# EAGLE design 12_BCKPLN_FPGA_J008340C (EAGLE 7.7.0)

## Sheet 1 of 2
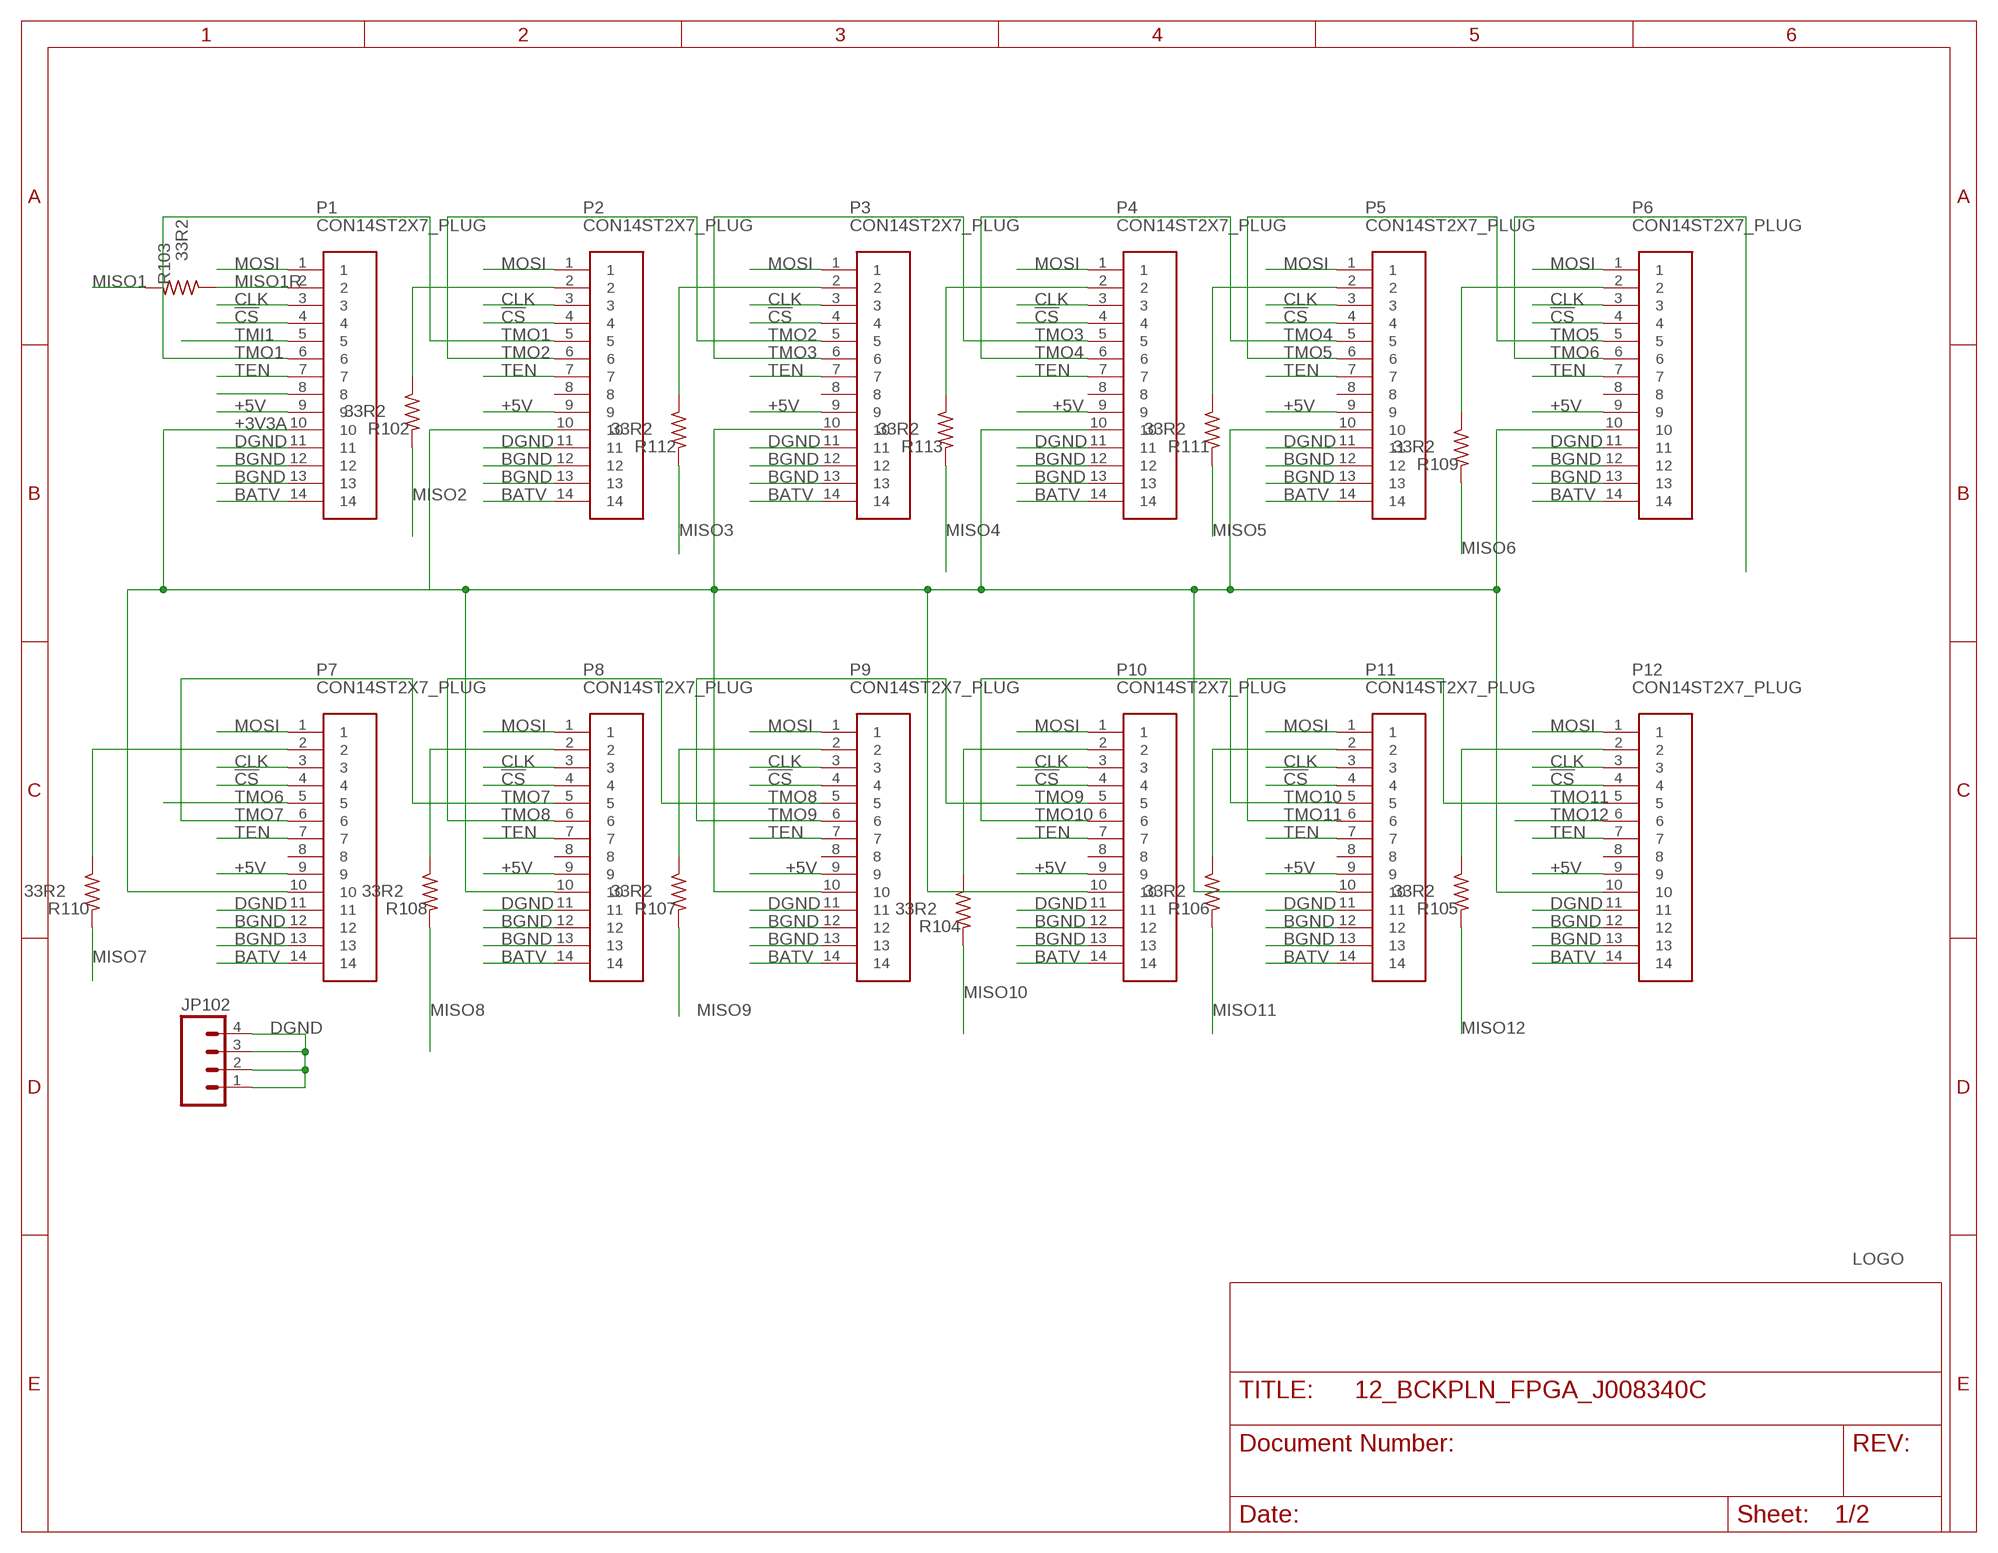
[diagram p0: schematic, sheet 1]

### Parts
JP102  M04LOCK  [1X04_LOCK]
P1  CON14ST2X7_PLUG  [2X7_PLUG]
P2  CON14ST2X7_PLUG  [2X7_PLUG]
P3  CON14ST2X7_PLUG  [2X7_PLUG]
P4  CON14ST2X7_PLUG  [2X7_PLUG]
P5  CON14ST2X7_PLUG  [2X7_PLUG]
P6  CON14ST2X7_PLUG  [2X7_PLUG]
P7  CON14ST2X7_PLUG  [2X7_PLUG]
P8  CON14ST2X7_PLUG  [2X7_PLUG]
P9  CON14ST2X7_PLUG  [2X7_PLUG]
P10  CON14ST2X7_PLUG  [2X7_PLUG]
P11  CON14ST2X7_PLUG  [2X7_PLUG]
P12  CON14ST2X7_PLUG  [2X7_PLUG]
R102  33R2  RESISTOR_SM0805S  [0805S]
R103  33R2  RESISTOR_SM0805S  [0805S]
R104  33R2  RESISTOR_SM0805S  [0805S]
R105  33R2  RESISTOR_SM0805S  [0805S]
R106  33R2  RESISTOR_SM0805S  [0805S]
R107  33R2  RESISTOR_SM0805S  [0805S]
R108  33R2  RESISTOR_SM0805S  [0805S]
R109  33R2  RESISTOR_SM0805S  [0805S]
R110  33R2  RESISTOR_SM0805S  [0805S]
R111  33R2  RESISTOR_SM0805S  [0805S]
R112  33R2  RESISTOR_SM0805S  [0805S]
R113  33R2  RESISTOR_SM0805S  [0805S]
U$1  JFRC-LOGOLOGO_OP  [LOGO_BMP_OP]

### Nets
!CS: P1.4 P2.4 P3.4 P4.4 P5.4 P6.4 P7.4 P8.4 P9.4 P10.4 P11.4 P12.4 ; also sheet 2
+3V3A: P1.10 P2.10 P3.10 P4.10 P5.10 P6.10 P7.10 P8.10 P9.10 P10.10 P11.10 P12.10 ; also sheet 2
+5V: P1.9 P2.9 P3.9 P4.9 P5.9 P6.9 P7.9 P8.9 P9.9 P10.9 P11.9 P12.9 ; also sheet 2
BATV: P1.14 P2.14 P3.14 P4.14 P5.14 P6.14 P7.14 P8.14 P9.14 P10.14 P11.14 P12.14 ; also sheet 2
BGND: P1.12 P1.13 P2.12 P2.13 P3.12 P3.13 P4.12 P4.13 P5.12 P5.13 P6.12 P6.13 P7.12 P7.13 P8.12 P8.13 P9.12 P9.13 P10.12 P10.13 P11.12 P11.13 P12.12 P12.13 ; also sheet 2
CLK: P1.3 P2.3 P3.3 P4.3 P5.3 P6.3 P7.3 P8.3 P9.3 P10.3 P11.3 P12.3 ; also sheet 2
DGND: JP102.1 JP102.2 JP102.3 JP102.4 P1.11 P2.11 P3.11 P4.11 P5.11 P6.11 P7.11 P8.11 P9.11 P10.11 P11.11 P12.11 ; also sheet 2
MISO1: R103.2 ; also sheet 2
MISO1R: P1.2 R103.1
MISO2: R102.2 ; also sheet 2
MISO3: R112.2 ; also sheet 2
MISO4: R113.2 ; also sheet 2
MISO5: R111.2 ; also sheet 2
MISO6: R109.2 ; also sheet 2
MISO7: R110.2 ; also sheet 2
MISO8: R108.2 ; also sheet 2
MISO9: R107.2 ; also sheet 2
MISO10: R104.2 ; also sheet 2
MISO11: R106.2 ; also sheet 2
MISO12: R105.2 ; also sheet 2
MOSI: P1.1 P2.1 P3.1 P4.1 P5.1 P6.1 P7.1 P8.1 P9.1 P10.1 P11.1 P12.1 ; also sheet 2
N$13: P2.2 R102.1
N$14: P3.2 R112.1
N$17: P1.8
N$24: P4.2 R113.1
N$25: P5.2 R111.1
N$28: P6.2 R109.1
N$31: P12.2 R105.1
N$32: P11.2 R106.1
N$33: P10.2 R104.1
N$34: P9.2 R107.1
N$35: P8.2 R108.1
N$36: P7.2 R110.1
TEN: P1.7 P2.7 P3.7 P4.7 P5.7 P6.7 P7.7 P8.7 P9.7 P10.7 P11.7 P12.7 ; also sheet 2
TMI1: P1.5 ; also sheet 2
TMO1: P1.6 P2.5
TMO2: P2.6 P3.5
TMO3: P3.6 P4.5
TMO4: P4.6 P5.5
TMO5: P5.6 P6.5
TMO6: P6.6 P7.5
TMO7: P7.6 P8.5
TMO8: P8.6 P9.5
TMO9: P9.6 P10.5
TMO10: P10.6 P11.5
TMO11: P11.6 P12.5
TMO12: P12.6 ; also sheet 2
Unconnected: P2.8 P3.8 P4.8 P5.8 P6.8 P7.8 P8.8 P9.8 P10.8 P11.8 P12.8

## Sheet 2 of 2
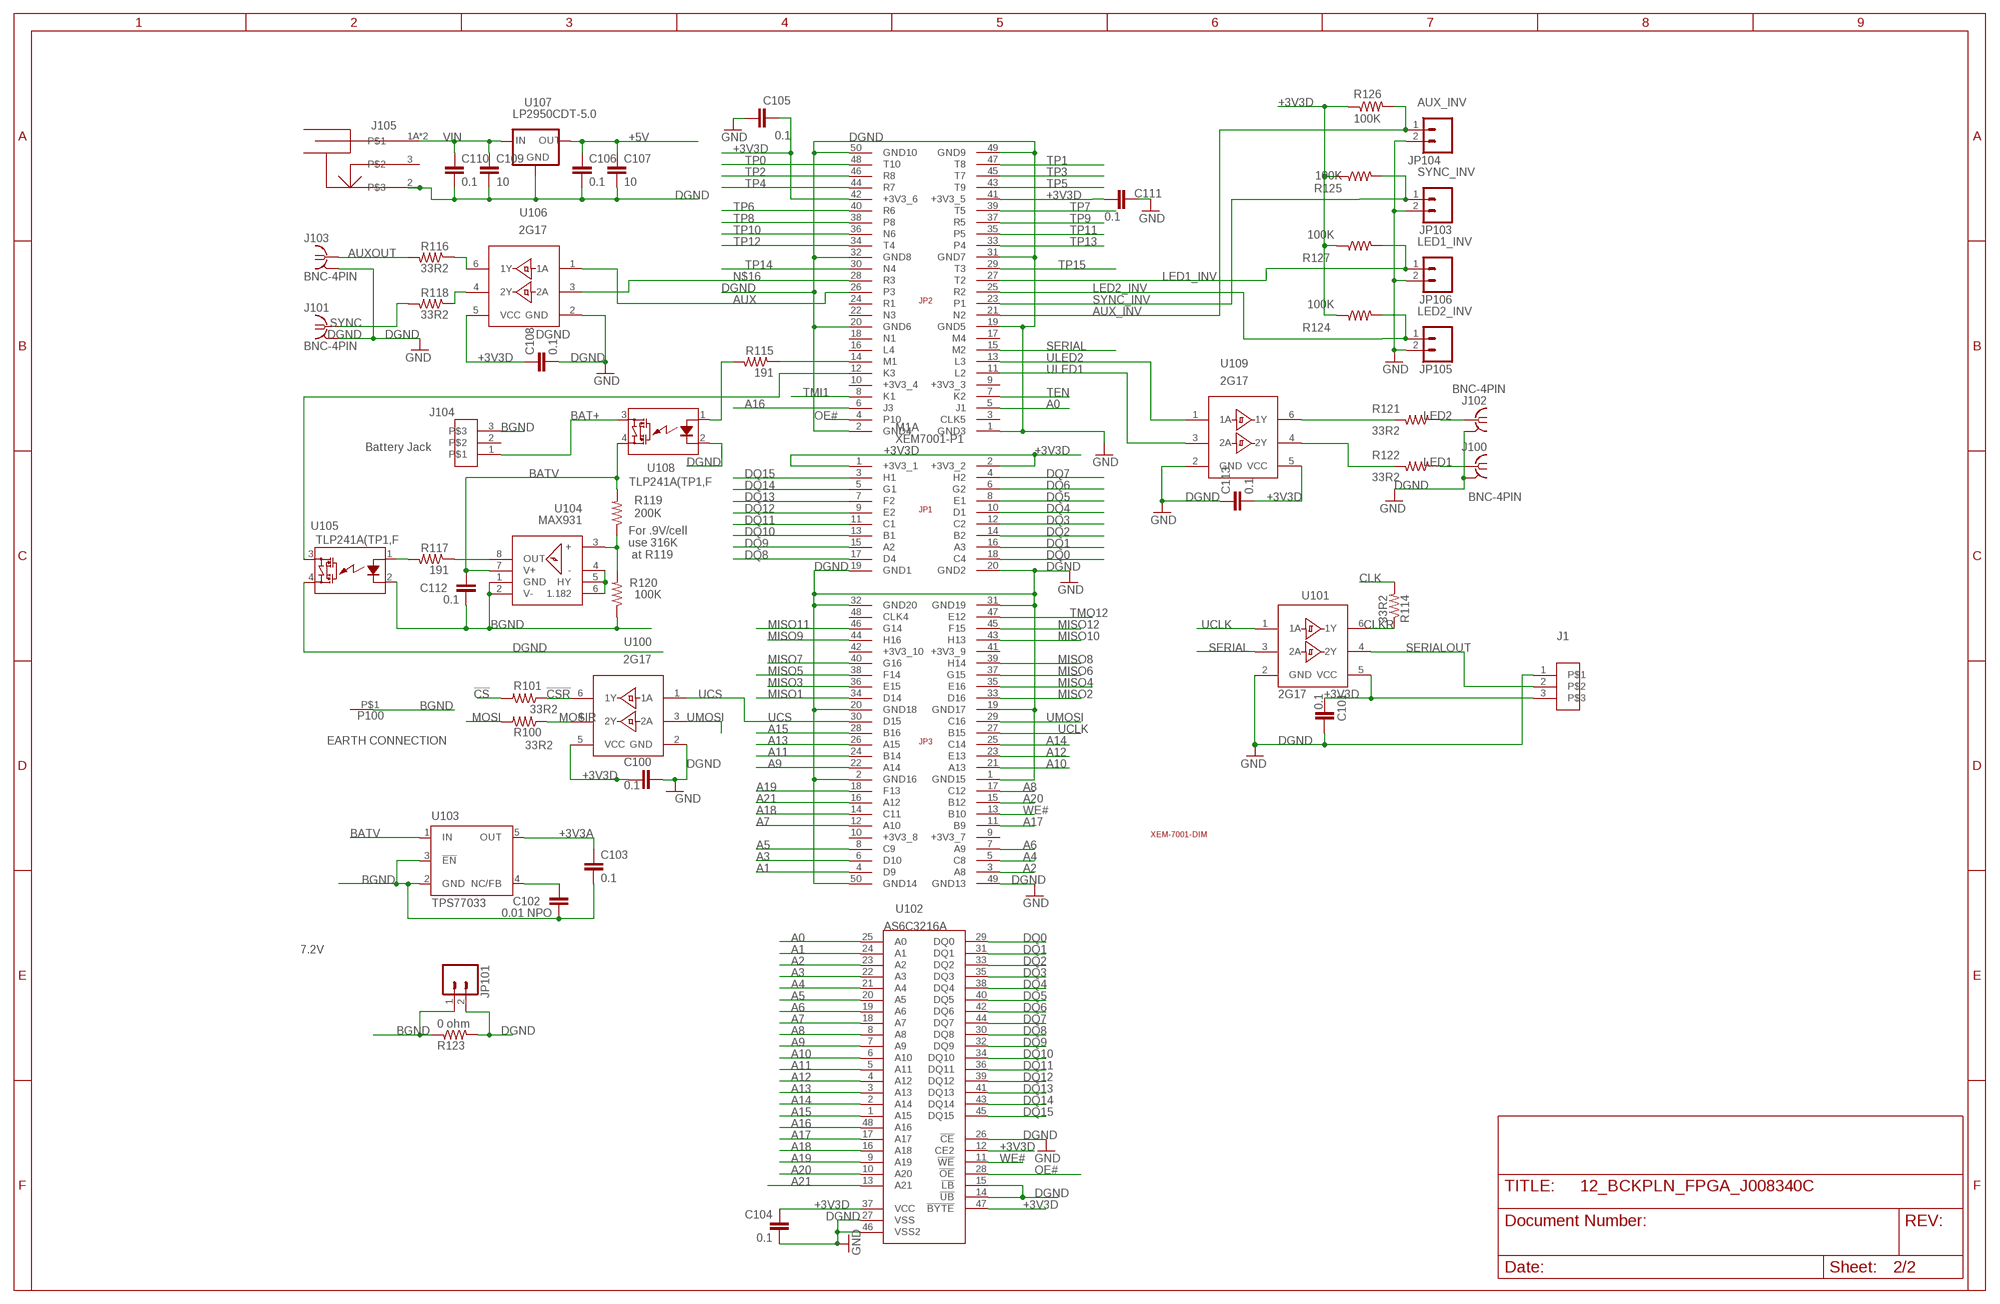
[diagram p1: schematic, sheet 2]

### Parts
C100  0.1  CAPS0603S  [0603S]
C101  0.1  CAPS0603S  [0603S]
C102  0.01 NPO  CAPS0805S  [0805S]
C103  0.1  CAPS0603S  [0603S]
C104  0.1  CAPS0603S  [0603S]
C105  0.1  CAPS0603S  [0603S]
C106  0.1  CAPS0603S  [0603S]
C107  10  CAPS1210S  [1210S]
C108  0.1  CAPS0603S  [0603S]
C109  10  CAPS1210S  [1210S]
C110  0.1  CAPS0603S  [0603S]
C111  0.1  CAPS0603S  [0603S]
C112  0.1  CAPS0603S  [0603S]
C113  0.1  CAPS0603S  [0603S]
J1  CON3AMPMODU-3  [AMPMODU-3]
J100  BNC-4PIN  BNCBNC-4PIN  [BNC-4PIN]
J101  BNC-4PIN  BNCBNC-4PIN  [BNC-4PIN]
J102  BNC-4PIN  BNCBNC-4PIN  [BNC-4PIN]
J103  BNC-4PIN  BNCBNC-4PIN  [BNC-4PIN]
J104  Battery Jack  CON3975  [975]
J105  POWER_JACK_SHUNTPJ-002  [PJ-002]
JP101  M02LOCK  [1X02_LOCK]
JP103  M02LOCK  [1X02_LOCK]
JP104  M02LOCK  [1X02_LOCK]
JP105  M02LOCK  [1X02_LOCK]
JP106  M02LOCK  [1X02_LOCK]
M1  XEM7001-OUTLINE  [XEM7001-OUTLINE]
M1A  XEM7001-P1  [2X10]
M1B  XEM7001-P2  [2X25]
M1C  XEM7001-P3  [2X25]
P100  CON1BANANA-1  [BANANA-1]
R100  33R2  RESISTOR_SM0805S  [0805S]
R101  33R2  RESISTOR_SM0805S  [0805S]
R114  33R2  RESISTOR_SM0805S  [0805S]
R115  191  RESISTOR_SM0805S  [0805S]
R116  33R2  RESISTOR_SM0805S  [0805S]
R117  191  RESISTOR_SM0805S  [0805S]
R118  33R2  RESISTOR_SM0805S  [0805S]
R119  200K  RESISTOR_SM0805S  [0805S]
R120  100K  RESISTOR_SM0805S  [0805S]
R121  33R2  RESISTOR_SM0805S  [0805S]
R122  33R2  RESISTOR_SM0805S  [0805S]
R123  0 ohm  RESISTOR_SM0805S  [0805S]
R124  100K  RESISTOR_SM0805S  [0805S]
R125  100K  RESISTOR_SM0805S  [0805S]
R126  100K  RESISTOR_SM0805S  [0805S]
R127  100K  RESISTOR_SM0805S  [0805S]
U100  2G17  [SOT23-6]
U101  2G17  [SOT23-6]
U102  AS6C3216A  [TSSOP48-12X20]
U103  TPS77033  [SOT23-DBV]
U104  MAX931  [SOIC8]
U105  TLP241A(TP1,F  RELAY_SSRSMD4-GULL  [SMD4-GULL]
U106  2G17  [SOT23-6]
U107  LP2950CDT-5.0  [DPACK]
U108  TLP241A(TP1,F  RELAY_SSRSMD4-GULL  [SMD4-GULL]
U109  2G17  [SOT23-6]

### Nets
!CS: R101.2 ; also sheet 1
!CSR: R101.1 U100.6(1Y)
+3V3A: C103.1 U103.5(OUT) ; also sheet 1
+3V3D: C100.1 C101.1 C104.1 C105.1 C108.1 C111.1 C113.2 J1.3 M1A.1(+3V3_1) M1A.2(+3V3_2) M1B.41(+3V3_5) M1B.42(+3V3_6) R124.1 R125.1 R126.1 R127.1 U100.5(VCC) U101.5(VCC) U102.12(CE2) U102.37(VCC) U102.47(!BYTE) U106.5(VCC) U109.5(VCC)
+5V: C106.1 C107.1 U107.3(OUT) ; also sheet 1
A0: M1B.5(J1) U102.25(A0)
A1: M1C.4(D9) U102.24(A1)
A2: M1C.3(A8) U102.23(A2)
A3: M1C.6(D10) U102.22(A3)
A4: M1C.5(C8) U102.21(A4)
A5: M1C.8(C9) U102.20(A5)
A6: M1C.7(A9) U102.19(A6)
A7: M1C.12(A10) U102.18(A7)
A8: M1C.17(C12) U102.8(A8)
A9: M1C.22(A14) U102.7(A9)
A10: M1C.21(A13) U102.6(A10)
A11: M1C.24(B14) U102.5(A11)
A12: M1C.23(E13) U102.4(A12)
A13: M1C.26(A15) U102.3(A13)
A14: M1C.25(C14) U102.2(A14)
A15: M1C.28(B16) U102.1(A15)
A16: M1B.6(J3) U102.48(A16)
A17: M1C.11(B9) U102.17(A17)
A18: M1C.14(C11) U102.16(A18)
A19: M1C.18(F13) U102.9(A19)
A20: M1C.15(B12) U102.10(A20)
A21: M1C.16(A12) U102.13(A21)
AUX: M1B.26(P3) U106.1(1A)
AUX_INV: JP104.1 M1B.21(N2) R126.2
AUXOUT: J103.S R116.2
BAT+: J104.1 U108.3(DS1)
BATV: C112.1 R119.2 U103.1(IN) U104.7(V+) U108.4(DS2) ; also sheet 1
BGND: C102.2 C103.2 C112.2 J104.3 JP101.1 P100.P$1 R120.1 R123.1 U103.2(GND) U103.3(!EN) U104.1(GND) U104.2(V-) U105.2(K) ; also sheet 1
CLK: R114.2 ; also sheet 1
CLKR: R114.1 U101.6(1Y)
DGND: C100.2 C101.2 C104.2 C105.2 C106.2 C107.2 C108.2 C109.2 C110.2 C111.2 C113.1 J1.1 J100.G1(GND) J100.G2(GND) J100.G3(GND) J100.G4(GND) J101.G1(GND) J101.G2(GND) J101.G3(GND) J101.G4(GND) J102.G1(GND) J102.G2(GND) J102.G3(GND) J102.G4(GND) J103.G1(GND) J103.G2(GND) J103.G3(GND) J103.G4(GND) J105.2 JP101.2 JP103.2 JP104.2 JP105.2 JP106.2 M1A.19(GND1) M1A.20(GND2) M1B.1(GND3) M1B.2(GND4) M1B.19(GND5) M1B.20(GND6) M1B.31(GND7) M1B.32(GND8) M1B.49(GND9) M1B.50(GND10) M1C.1(GND15) M1C.2(GND16) M1C.19(GND17) M1C.20(GND18) M1C.31(GND19) M1C.32(GND20) M1C.49(GND13) M1C.50(GND14) R123.2 U100.2(GND) U101.2(GND) U102.14(!UB) U102.15(!LB) U102.26(!CE) U102.27(VSS) U102.46(VSS2) U105.4(DS2) U106.2(GND) U107.4(GND) U108.2(K) U109.2(GND) ; supply symbol labelled GND ; also sheet 1
DQ0: M1A.18(C4) U102.29(DQ0)
DQ1: M1A.16(A3) U102.31(DQ1)
DQ2: M1A.14(B2) U102.33(DQ2)
DQ3: M1A.12(C2) U102.35(DQ3)
DQ4: M1A.10(D1) U102.38(DQ4)
DQ5: M1A.8(E1) U102.40(DQ5)
DQ6: M1A.6(G2) U102.42(DQ6)
DQ7: M1A.4(H2) U102.44(DQ7)
DQ8: M1A.17(D4) U102.30(DQ8)
DQ9: M1A.15(A2) U102.32(DQ9)
DQ10: M1A.13(B1) U102.34(DQ10)
DQ11: M1A.11(C1) U102.36(DQ11)
DQ12: M1A.9(E2) U102.39(DQ12)
DQ13: M1A.7(F2) U102.41(DQ13)
DQ14: M1A.5(G1) U102.43(DQ14)
DQ15: M1A.3(H1) U102.45(DQ15)
LED1: J100.S R122.1
LED1_INV: JP106.1 M1B.27(T2) R127.2
LED2: J102.S R121.1
LED2_INV: JP105.1 M1B.25(R2) R124.2
MISO1: M1C.34(D14) ; also sheet 1
MISO2: M1C.33(D16) ; also sheet 1
MISO3: M1C.36(E15) ; also sheet 1
MISO4: M1C.35(E16) ; also sheet 1
MISO5: M1C.38(F14) ; also sheet 1
MISO6: M1C.37(G15) ; also sheet 1
MISO7: M1C.40(G16) ; also sheet 1
MISO8: M1C.39(H14) ; also sheet 1
MISO9: M1C.44(H16) ; also sheet 1
MISO10: M1C.43(H13) ; also sheet 1
MISO11: M1C.46(G14) ; also sheet 1
MISO12: M1C.45(F15) ; also sheet 1
MOSI: R100.2 ; also sheet 1
MOSIR: R100.1 U100.4(2Y)
N$1: R117.2 U105.1(A)
N$2: R121.2 U109.6(1Y)
N$3: R115.2 U108.1(A)
N$4: M1B.14(M1) R115.1
N$7: C102.1 U103.4(NC/FB)
N$15: R117.1 U104.8(OUT)
N$16: M1B.28(R3) U106.3(2A)
N$18: R119.1 R120.2 U104.3(+)
N$21: R116.1 U106.6(1Y)
N$23: R118.1 U106.4(2Y)
N$37: R122.2 U109.4(2Y)
OE#: M1B.4(P10) U102.28(!OE)
REF: U104.4(-) U104.5(HY) U104.6(1.182)
SERIAL: M1B.15(M2) U101.3(2A)
SERIALOUT: J1.2 U101.4(2Y)
SYNC: J101.S R118.2
SYNC_INV: JP103.1 M1B.23(P1) R125.2
TEN: M1B.7(K2) ; also sheet 1
TMI1: M1B.8(K1) ; also sheet 1
TMO12: M1C.47(E12) ; also sheet 1
TP0: M1B.48(T10)
TP1: M1B.47(T8)
TP2: M1B.46(R8)
TP3: M1B.45(T7)
TP4: M1B.44(R7)
TP5: M1B.43(T9)
TP6: M1B.40(R6)
TP7: M1B.39(T5)
TP8: M1B.38(P8)
TP9: M1B.37(R5)
TP10: M1B.36(N6)
TP11: M1B.35(P5)
TP12: M1B.34(T4)
TP13: M1B.33(P4)
TP14: M1B.30(N4)
TP15: M1B.29(T3)
UCLK: M1C.27(B15) U101.1(1A)
UCS: M1C.30(D15) U100.1(1A)
ULED1: M1B.11(L2) U109.3(2A)
ULED2: M1B.13(L3) U109.1(1A)
UMOSI: M1C.29(C16) U100.3(2A)
VCHECK: M1B.12(K3) U105.3(DS1)
VIN: C109.1 C110.1 J105.1A J105.1B U107.1(IN)
WE#: M1C.13(B10) U102.11(!WE)
Unconnected: J104.2 J105.3 M1B.3(CLK5) M1B.9(+3V3_3) M1B.10(+3V3_4) M1B.16(L4) M1B.17(M4) M1B.18(N1) M1B.22(N3) M1B.24(R1) M1C.9(+3V3_7) M1C.10(+3V3_8) M1C.41(+3V3_9) M1C.42(+3V3_10) M1C.48(CLK4)

### Notes on the sheet
- For .9V/cell
  use 316K
   at R119
- EARTH CONNECTION
- 7.2V

## Library data of the parts
C100-C113 = STEVES_BU:CAPS
J1 J104 = STEVES_BU:CON3
J100-J103 = STEVES_BU:BNC
J105 = STEVES_BU:POWER_JACK_SHUNT
JP101 JP103-JP106 = SparkFun:M02: Header 2 Standard 2-pin 0.1" header. Use with straight break away headers (SKU : PRT-00116), right angle break away headers (PRT-00553), swiss pins (PRT-00743), machine pins (PRT-00117), and female headers (PRT-00115). Molex polarized connector foot print use with SKU : PRT-08233 with associated crimp pins and housings.
JP102 = SparkFun:M04: Header 4 Standard 4-pin 0.1" header. Use with straight break away headers (SKU : PRT-00116), right angle break away headers (PRT-00553), swiss pins (PRT-00743), machine pins (PRT-00117), and female headers (PRT-00115). Molex polarized connector foot print use with SKU : PRT-08231 with associated crimp pins and housings.
M1 = STEVES_BU:XEM7001-OUTLINE
M1A = STEVES_BU:XEM7001-P1
M1B = STEVES_BU:XEM7001-P2
M1C = STEVES_BU:XEM7001-P3
P1-P12 = STEVES_BU:CON14ST
P100 = STEVES_BU:CON1
R100-R115 R117 R119 R120 R123-R127 = STEVES_BU:RESISTOR_SM
R116 R118 R121 R122 = STEVES:RESISTOR_SM
U100 U101 U106 U109 = STEVES_BU:2G17
U102 = STEVES_BU:AS6C3216A: 32M Bits(2Mx16/4Mx8 Switchable) LOW POWER CMOS SRAM
U103 = texas:TPS770*: ULTRALOW-POWER 50-mA LOW-DROPOUT LINEAR REGULATORS 50-mA Low-Dropout Regulator Source: http://focus.ti.com/lit/ds/symlink/tps77001.pdf; MF: TEXAS INSTRUMENTS; MPN: TPS77033DBVT; OC_FARNELL: 8461570; OC_NEWARK: 77C1187
U104 = STEVES_BU:MAX931
U105 U108 = STEVES_BU:RELAY_SSR
U107 = v-reg:LP2950?*: Source: http://cache.national.com/ds/LP/LP2950.pdf
U$1 = STEVES_BU:JFRC-LOGO

## Board
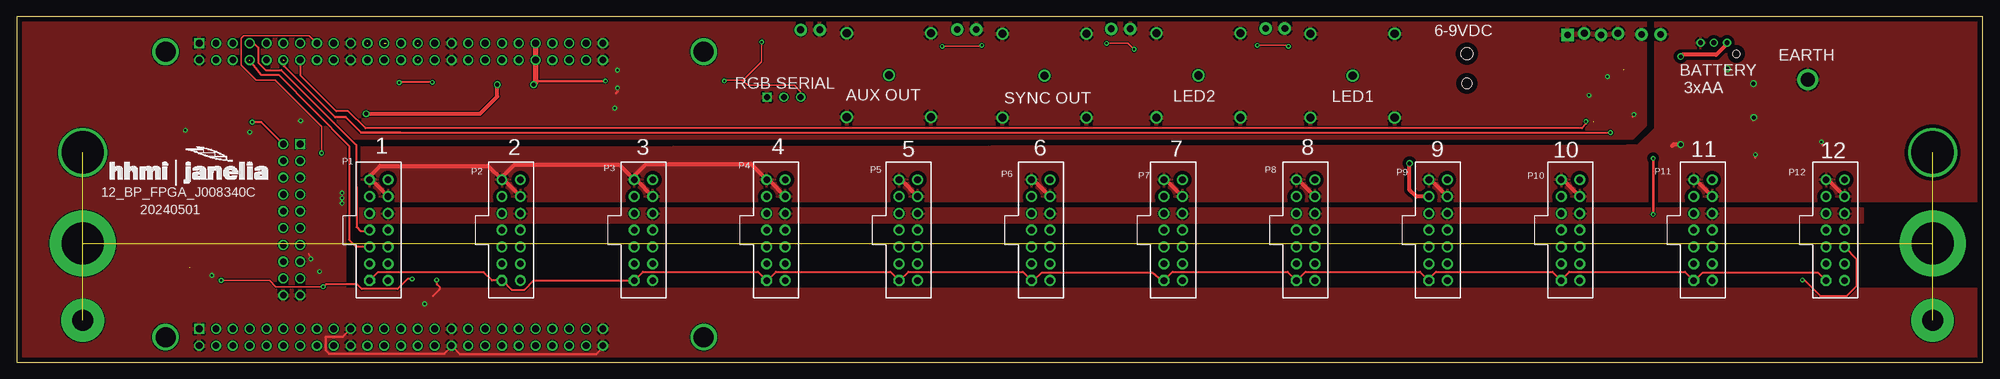
[diagram p2: board, top side]
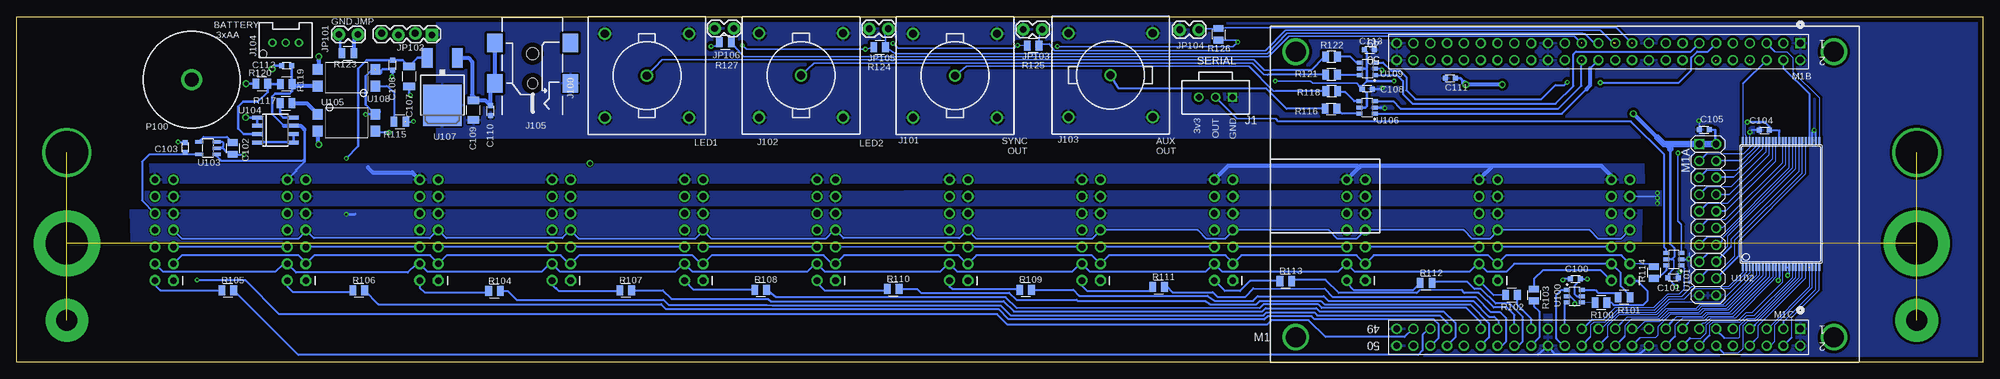
[diagram p3: board, bottom side, seen from below]

Size 297 x 52.3 mm. Coordinates in mm from the lower left corner, seen from the top.
Outline: 0,0 297,0 297,52.3 0,52.3 0,0
Copper layers (1*16): Top 0.035mm / dielectric 1.5mm / Bottom 0.035mm
Design rules "default *": minimum track width 0.15mm, minimum drill 8mil, track to track 0.15mm, track to pad 0.15mm, pad to pad 0.15mm, via to via 0.15mm, smd to smd 0.15mm, copper to edge 30mil, drill to drill 8mil, minimum pad ring 10mil, minimum via ring 8mil, stop-mask expansion 4mil, vias tented up to drill 25mil, thermal gap 10mil

### Footprints (pad centres in the part's own frame; a part is rotated, then mirrored left to right if it is on the bottom)
0603S = smd 0.762 x 0.762: 1 -0.762,0; 2 0.762,0
0805S = smd 1.016 x 1.524: 1 -0.889,0; 2 0.889,0
1210S = smd 1.14 x 1.75: 1 -1.5,0; 2 1.5,0
AMPMODU-3 = drill 0.889 square: 1 -2.54,0 | drill 0.889: 2 0,0; 3 2.54,0
BNC-4PIN = drill 1.219: G1 -6.35,6.35; G2 6.35,6.35; G3 6.35,-6.35; G4 -6.35,-6.35; S 0,0
975 = drill 0.71: 1 2,0; 2 0,0; 3 -2,0 | hole 1.1: 3.4,1.7
PJ-002 = smd 2.8 x 2.4: 1A 5,5.7; 1B 11.1,5.7; 2 5,-5.7; 3 11.1,-5.7 | hole 1.6: 5,0 | hole 1.8: 9.5,0
1X02_LOCK = drill 1.016 pad 1.88: 1 -0.178,0; 2 2.718,0
1X04_LOCK = drill 1.016 pad 1.88 square: 1 0,0.127 | drill 1.016 pad 1.88: 2 2.54,-0.127; 3 5.08,0.127; 4 7.62,-0.127
XEM7001-OUTLINE = drill 2.997: A 3.81,3.81; B 3.81,85.09; C 46.99,3.81; D 46.99,85.09
2X10 = drill 1.016 square: 1 -11.43,-1.27 | drill 1.016: 2 -11.43,1.27; 3 -8.89,-1.27; 4 -8.89,1.27; 5 -6.35,-1.27; 6 -6.35,1.27; 7 -3.81,-1.27; 8 -3.81,1.27; 9 -1.27,-1.27; 10 -1.27,1.27; 11 1.27,-1.27; 12 1.27,1.27; 13 3.81,-1.27; 14 3.81,1.27; 15 6.35,-1.27; 16 6.35,1.27; 17 8.89,-1.27; 18 8.89,1.27; 19 11.43,-1.27; 20 11.43,1.27
2X25 = drill 1.016 square: 1 -30.48,-1.27 | drill 1.016: 2 -30.48,1.27; 3 -27.94,-1.27; 4 -27.94,1.27; 5 -25.4,-1.27; 6 -25.4,1.27; 7 -22.86,-1.27; 8 -22.86,1.27; 9 -20.32,-1.27; 10 -20.32,1.27; 11 -17.78,-1.27; 12 -17.78,1.27; 13 -15.24,-1.27; 14 -15.24,1.27; 15 -12.7,-1.27; 16 -12.7,1.27; 17 -10.16,-1.27; 18 -10.16,1.27; 19 -7.62,-1.27; 20 -7.62,1.27; 21 -5.08,-1.27; 22 -5.08,1.27; 23 -2.54,-1.27; 24 -2.54,1.27; 25 0,-1.27; 26 0,1.27; 27 2.54,-1.27; 28 2.54,1.27; 29 5.08,-1.27; 30 5.08,1.27; 31 7.62,-1.27; 32 7.62,1.27; 33 10.16,-1.27; 34 10.16,1.27; 35 12.7,-1.27; 36 12.7,1.27; 37 15.24,-1.27; 38 15.24,1.27; 39 17.78,-1.27; 40 17.78,1.27; 41 20.32,-1.27; 42 20.32,1.27; 43 22.86,-1.27; 44 22.86,1.27; 45 25.4,-1.27; 46 25.4,1.27; 47 27.94,-1.27; 48 27.94,1.27; 49 30.48,-1.27; 50 30.48,1.27
2X7_PLUG = drill 1.016 pad 1.651 octagon: 1 -1.397,-7.62 | drill 1.016 pad 1.651: 2 1.397,-7.62; 3 -1.397,-5.08; 4 1.397,-5.08; 5 -1.397,-2.54; 6 1.397,-2.54; 7 -1.397,0; 8 1.397,0; 9 -1.397,2.54; 10 1.397,2.54; 11 -1.397,5.08; 12 1.397,5.08; 13 -1.397,7.62; 14 1.397,7.62
BANANA-1 = drill 2.1: P$1 0,0
SOT23-6 = smd 0.6 x 0.9: 1 -0.95,-1.15; 2 0,-1.15; 3 0.95,-1.15; 4 0.95,1.15; 5 0,1.15; 6 -0.95,1.15
TSSOP48-12X20 = smd 1.1 x 0.3: 1 -9.575,5.75; 2 -9.575,5.25; 3 -9.575,4.75; 4 -9.575,4.25; 5 -9.575,3.75; 6 -9.575,3.25; 7 -9.575,2.75; 8 -9.575,2.25; 9 -9.575,1.75; 10 -9.575,1.25; 11 -9.575,0.75; 12 -9.575,0.25; 13 -9.575,-0.25; 14 -9.575,-0.75; 15 -9.575,-1.25; 16 -9.575,-1.75; 17 -9.575,-2.25; 18 -9.575,-2.75; 19 -9.575,-3.25; 20 -9.575,-3.75; 21 -9.575,-4.25; 22 -9.575,-4.75; 23 -9.575,-5.25; 24 -9.575,-5.75; 25 9.575,-5.75; 26 9.575,-5.25; 27 9.575,-4.75; 28 9.575,-4.25; 29 9.575,-3.75; 30 9.575,-3.25; 31 9.575,-2.75; 32 9.575,-2.25; 33 9.575,-1.75; 34 9.575,-1.25; 35 9.575,-0.75; 36 9.575,-0.25; 37 9.575,0.25; 38 9.575,0.75; 39 9.575,1.25; 40 9.575,1.75; 41 9.575,2.25; 42 9.575,2.75; 43 9.575,3.25; 44 9.575,3.75; 45 9.575,4.25; 46 9.575,4.75; 47 9.575,5.25; 48 9.575,5.75
SOT23-DBV = smd 0.55 x 1.2: 1 -0.95,-1.3; 2 0,-1.3; 3 0.95,-1.3; 4 0.95,1.3; 5 -0.95,1.3
SOIC8 = smd 0.6 x 1.5: 1 -1.905,-2.75; 2 -0.635,-2.75; 3 0.635,-2.75; 4 1.905,-2.75; 5 1.905,2.75; 6 0.635,2.75; 7 -0.635,2.75; 8 -1.905,2.75
SMD4-GULL = smd 1.6 x 1.5: 1 -1.27,-4.35; 2 1.27,-4.35; 3 1.27,4.35; 4 -1.27,4.35
DPACK = smd 1.6 x 3: 1 -2.28,-4.8; 3 2.28,-4.8 | smd 5.8 x 6.2: 4 0,2.38

### Placement (x,y rotation side)
C100  61.55,12.65 180 bottom
C101  46.8,12.8 0 bottom
C102  264.35,32.35 270 bottom
C103  271.55,32.5 90 bottom
C104  33,35.1 180 bottom
C105  42.1,35.2 180 bottom
C106  240.2,44.95 270 bottom
C107  237.7,43.25 270 bottom
C108  93,41.35 0 bottom
C109  228,38.15 270 bottom
C110  225.4,38.05 270 bottom
C111  80.45,43 180 bottom
C112  256.2,44.9 180 bottom
C113  92.65,47.3 180 bottom
J1  115.9,40.1 180 bottom
J100  201.8,43.35 90 bottom
J101  155.25,43.35 90 bottom
J102  178.5,43.4 90 bottom
J103  131.75,43.45 180 bottom
J104  256.35,48.35 180 bottom
J105  219.05,37.2 90 bottom
JP101  248.15,49.6 0 bottom
JP102  234.25,49.64 180 bottom
JP103  142.25,50.35 180 bottom
JP104  118.6,50.3 180 bottom
JP105  165.5,50.45 180 bottom
JP106  188.85,50.5 180 bottom
M1  18.7,0 90 bottom
M1A  41.56,21.59 270 bottom
M1B  58.07,46.99 180 bottom
M1C  58.07,3.81 180 bottom
P1  54.7,20 0 top
P2  74.7,20 0 top
P3  94.7,20 0 top
P4  114.7,20 0 top
P5  134.7,20 0 top
P6  154.7,20 0 top
P7  174.7,20 0 top
P8  194.7,20 0 top
P9  214.7,20 0 top
P10  234.7,20 0 top
P11  254.7,20 0 top
P12  274.7,20 0 top
P100  270.55,42.75 270 bottom
R100  57.7,9.05 0 bottom
R101  54.2,9.85 0 bottom
R102  71.2,10.2 0 bottom
R103  67.8,10.2 270 bottom
R104  224.8,10.8 0 bottom
R105  265.1,10.9 0 bottom
R106  245.3,10.9 0 bottom
R107  205,10.9 0 bottom
R108  184.6,11 0 bottom
R109  144.6,11 0 bottom
R110  164.6,11.1 0 bottom
R111  124.5,11.4 0 bottom
R112  84.1,12 0 bottom
R113  105.3,12.3 0 bottom
R114  49.7,13.6 90 bottom
R115  239.1,36.4 180 bottom
R116  98.45,38.35 180 bottom
R117  256.3,39.2 0 bottom
R118  98.35,41.05 180 bottom
R119  256.25,42.1 0 bottom
R120  259.95,42.15 0 bottom
R121  98.4,43.5 0 bottom
R122  98.4,46.2 0 bottom
R123  246.95,46.75 0 bottom
R124  166.65,47.65 0 bottom
R125  143.45,47.9 0 bottom
R126  115.45,49.6 90 bottom
R127  189.95,48.4 0 bottom
U100  61.7,10 270 bottom
U101  46.7,15.6 90 bottom
U102  30.5,23.95 90 bottom
U103  268.1,32.4 90 bottom
U104  257.9,35.15 270 bottom
U105  247.15,36.25 270 bottom
U106  93,38.55 90 bottom
U107  232.7,41.25 180 bottom
U108  247.15,43.05 90 bottom
U109  92.95,44.4 90 bottom
U$1  24.2,28.2 0 top

### Tracks (layer width: path | path; a pad name or v marks a point on that pad's centre or on a via)
!CS
  Bottom 0.3: R101.2 53.31,10.16 54.7,11.55 54.7,13.52 P1.4
  Bottom 0.305: P1.4 56.88,14.92 56.9,14.9 70.8,14.9 72,13.7 74.88,13.7 P2.4 76.38,14.92 77.6,13.7 94.88,13.7 P3.4 96.18,14.92 97.4,13.7 114.88,13.7 P4.4 116.18,14.92 117.4,13.7 134.88,13.7 P5.4 136.38,14.92 137.6,13.7 154.88,13.7 P6.4 156.28,14.92 157.5,13.7 174.88,13.7 P7.4 176.38,14.92 177.6,13.7 194.88,13.7 P8.4 196.28,14.92 197.5,13.7 214.88,13.7 P9.4 216.48,14.92 217.7,13.7 234.88,13.7 P10.4 236.58,14.92 237.9,13.6 254.78,13.6 P11.4 256.68,14.92 257.9,13.7 274.88,13.7 P12.4
!CSR
  Bottom 0.3: U100.6 58.55,10.95 58.15,10.55 54.74,10.55 R101.1
+3V3A
  Bottom 0.3: 271.5,31.8 C103.1 271.26,31.45 | U103.5 271.26,31.45 | 271.26,31.45 276.95,31.45 278.05,30.35 278.05,24.49 P12.10
  pour Top: 51.55,23.05 51.6,21.15 278.95,21.15 278.95,23.25 51.6,23.25
+3V3D  (via drill 0.3, 0.6)
  Top 0.2: v139.8,47.8 145.75,47.8 v145.8,47.95 | v164.65,48.25 167.9,48.25 v168.8,47.35 | v187.4,47.95 191.95,47.95 v192.1,47.8 | v112.55,48.45 112.55,45.5 109.7,42.65 | 109.67,42.62 109.7,42.65 | 109.7,42.65 107,42.65 v106.9,42.55
  Top 0.254: v30.9,12.4 38.2,12.4 39.15,11.45 v46.3,11.45 | J1.3 118.44,40.96 117.5,41.9 110.4,41.9 109.67,42.62
  Top 0.3: v59.75,12.6 59.05,12.6 57.55,11.1 52.15,11.1 51.45,11.8 46.75,11.8 v46.3,11.45
  Top 0.406: v88.95,42.55 78.65,42.55 v78.1,42 | v35.6,36.35 36.96,36.35 M1A.2
  Top 0.61: v52.8,37.6 70,37.6 72.6,40.2 v72.6,42
  Top 0.813: M1B.41 M1B.42 78.39,42.29 v78.1,42
  Bottom 0.15: U102.47 35.75,34.25 35.9,34.4 35.9,36.05 v35.6,36.35
  Bottom 0.2: 113.25,47.75 139.55,47.75 v139.8,47.8 | R125.1 v145.8,47.95 145.95,47.95 146.35,47.55 163.85,47.55 v164.65,48.25 | v168.8,47.35 168.79,47.35 R124.1 167.65,47.55 168.95,47.35 186.75,47.35 v187.4,47.95 | v192.1,47.8 191.44,47.8 R127.1 | v106.9,42.55 101.55,42.55 101.2,42.2 94.55,42.2 94.15,41.8
  Bottom 0.254: U102.12 30.75,12.6 v30.9,12.4 | 46.7,15.45 46.7,14.2 47.55,13.35 47.55,12.81 | 47.55,12.81 C101.1 | 47.55,12.81 47.55,12.7 v46.3,11.45 | 113.25,47.75 v112.55,48.45 112.81,48.71 R126.1
  Bottom 0.3: U102.12 30.75,13.05 | U100.5 61.3,10 61.7,10.4 61.7,11.55 60.79,12.46 C100.1 59.8,12.65 v59.75,12.6 | 47.21,17.91 46.65,17.3 46.65,15.95 46.92,15.68 | 46.92,15.68 47.05,15.55 47.8,15.55 U101.5 | U102.37 30.75,34.85 | 30.75,34.85 30.75,35.1 | 30.75,34.85 31,35.1 C104.1 32.24,35.59 | 46.7,15.45 46.92,15.68 | C105.1 40.45,35.2 40.4,35.15
  Bottom 0.406: 40.45,35.15 40.4,35.15 40.4,33.13 M1A.2 | 78.2,42.1 v78.1,42 78.94,42.99 C111.1 | U109.5 93.25,44.4 | 93.25,44.4 93.05,44.6 93.05,46.94 C113.2 | U106.5 93.25,38.55 93.05,38.75 93.05,40.64 C108.1 93.76,41.41 94.15,41.8 93.8,41.8 93.05,42.55 93.05,42.65 | 93.25,44.4 93.05,44.2 93.05,42.65 | 93.05,42.65 92.95,42.55 v88.95,42.55 | 32.24,35.59 32.24,35.64 32.95,36.35 v35.6,36.35 | 47.2,32.3 47.2,18.27 47.21,17.91
  Bottom 0.61: 49.2,34 v52.8,37.6 | v72.6,42 v78.1,42
  Bottom 0.813: 78.39,42.29 v78.1,42
  Bottom 1.016: M1A.2 M1A.1 47.75,33.02 | 47.75,33.02 48.22,33.02 49.2,34 | 47.2,32.3 47.2,32.47 47.75,33.02
+5V  (via drill 0.3)
  Top 0.406: v247.2,30.85 v247.2,22.4
  Bottom 0.406: v247.2,30.85 245.4,32.75 245.4,44.45 244.15,45.7 240.21,45.7 C106.1 238.66,45.71 C107.1 237.7,44.8 236.4,46.1 235.03,46.1 U107.3 | v247.2,22.4 245.9,22.4 245.85,22.45
  pour Bottom: 51.6,18.4 51.5,23.05 279.8,23 279.7,18.4
A0
  Bottom 0.15: 31.41,47 29.6,47 28.7,46.1 28.7,44 24.75,40.05 U102.25
  Bottom 0.254: 31.41,47 M1B.5
A1
  Bottom 0.15: 28.9,3.77 28.9,6.8 24.75,10.95 U102.24
  Bottom 0.305: M1C.4 28.9,3.77
A2
  Bottom 0.15: M1C.3 30.1,5.11 | 30.1,6.2 25.25,11.05 U102.23
  Bottom 0.305: 30.1,5.11 30.1,6.2
A3
  Bottom 0.15: 32.06,2.54 31.4,3.2 31.4,5.7 25.75,11.35 U102.22
  Bottom 0.305: M1C.6 32.06,2.54
A4  (1 unrouted)
  Bottom 0.15: M1C.5 32.52,5.08 26.2,11.4 26.2,14.32
A5
  Bottom 0.15: 34.46,3.34 33.9,3.9 33.9,5.6 26.75,12.75 U102.20
  Bottom 0.305: M1C.8 34.46,3.34
A6
  Bottom 0.15: 34.42,5.68 27.25,12.85 U102.19
  Bottom 0.305: M1C.7 34.42,5.68
A7
  Bottom 0.15: M1C.12 40.16,2.54 | 39.15,1.4 37,1.4 36.3,2.1 36.3,5.5 35.5,6.3 34.3,6.3 27.75,12.85 U102.18
  Bottom 0.305: 39.15,1.4 M1C.12
A8
  Bottom 0.15: M1C.17 47.82,5.18 | 46.7,6.5 46.2,7 42.4,7 41.8,7.6 38.2,7.6 32.7,13.1 32.7,14.32 U102.8
  Bottom 0.305: 47.82,5.18 46.7,6.5
A9
  Bottom 0.15: U102.7 33.25,13.15 38.5,7.9 42.1,7.9 42.7,7.3 47.2,7.3 49.1,5.4 49.1,4.1 49.5,3.7 51.83,3.7
  Bottom 0.305: 51.83,3.7 M1C.22
A10
  Bottom 0.15: M1C.21 52.22,5.08 51.1,6.2 48.8,6.2 47.4,7.6 42.9,7.6 42.3,8.2 38.7,8.2 33.7,13.2 33.7,14.32 U102.6
A11
  Bottom 0.15: U102.5 34.25,13.15 38.9,8.5 42.5,8.5 43.1,7.9 47.6,7.9 48.9,6.6 53,6.6 54.1,5.5 54.1,3.97
  Bottom 0.305: 54.1,3.97 M1C.24
A12
  Bottom 0.15: M1C.23 | 54.6,6 53.7,6.9 49.1,6.9 47.8,8.2 43.3,8.2 42.7,8.8 39.2,8.8 34.7,13.3 34.7,14.32 U102.4
  Bottom 0.305: M1C.23 54.6,6
A13
  Bottom 0.15: U102.3 35.25,13.55 39.7,9.1 47.4,9.1 49.3,7.2 55,7.2 56.7,5.5 56.7,3.91
  Bottom 0.305: 56.7,3.91 M1C.26
A14
  Bottom 0.15: M1C.25 57.62,5.08 55.1,7.6 49.4,7.6 47.4,9.6 45.1,9.6 43.5,11.2 38.2,11.2 35.7,13.7 35.7,14.32 U102.2
A15
  Bottom 0.15: U102.1 36.25,13.65 38.4,11.5 44,11.5 45.5,10 47.5,10 49.6,7.9 55.3,7.9 57.1,6.1 58.8,6.1 59.3,5.6 59.3,3.85
  Bottom 0.305: 59.3,3.85 M1C.28
A16
  Bottom 0.15: 36.25,42.14 U102.48
  Bottom 0.254: 36.25,42.14 M1B.6
A17
  Bottom 0.15: M1C.11 40.29,4.89 | 39.1,3.7 36.9,3.7 36.7,3.9 36.7,5.6 35.6,6.7 34.4,6.7 28.25,12.85 U102.17
  Bottom 0.305: 40.29,4.89 39.1,3.7
A18
  Bottom 0.15: 41.3,4.07 41.3,5.6 40.8,6.1 36.7,6.1 35.7,7.1 34.5,7.1 28.75,12.85 U102.16
  Bottom 0.305: 41.3,4.07 M1C.14
A19
  Bottom 0.15: U102.9 32.25,12.95 37.9,7.3 41.6,7.3 42.2,6.7 45.4,6.7 46.5,5.6 46.5,3.95
  Bottom 0.305: 46.5,3.95 M1C.18
A20
  Bottom 0.15: 44.57,5.93 44.2,6.4 42,6.4 41.4,7 37.7,7 31.7,13 31.7,14.32 U102.10
  Bottom 0.305: M1C.15 44.57,5.93
A21
  Bottom 0.15: 44.3,3.65 42.6,3.65 41.8,4.45 41.8,5.65 41.05,6.4 36.95,6.4 35.75,7.6 34.8,7.6 30.25,12.15 U102.13
  Bottom 0.406: M1C.16 45.37,2.58 44.3,3.65
AUX
  Bottom 0.3: U106.1 63.6,37.6 59.9,41.3
  Bottom 0.305: 59.3,44.49 M1B.26
  Bottom 0.61: 59.9,41.3 59.3,41.9 59.3,44.49
AUX_INV  (1 unrouted)
  Bottom 0.2: 53.01,48.26 55.35,50.6 113.45,50.6 114.51,50.6 R126.2 118.01,50.46 JP104.1
AUXOUT
  Bottom 0.3: R116.2 105.2,38.35 108.25,41.4 130.5,41.4 J103.S
BAT+  (via drill 0.6)
  Top 0.61: J104.1 258.35,48.15 256.7,46.5 251.6,46.5 v251.35,46.25
  Bottom 0.61: v251.35,46.25 251.3,46.25 251.4,45.65 251.43,44.25 U108.3
BATV
  Top 0.61: P10.14 236.38,27.62
  Bottom 0.3: 253.5,30.8 253.8,30.5 266.1,30.5 266.8,31.2 U103.1
  Bottom 0.406: C112.1 255.44,42.18 R119.2 255.36,41.04 255.75,40.65 257.95,40.65 258.4,40.2 258.4,37.55 256.65,35.8 255.16,35.8 U104.7 | 253.5,35.2 253.5,30.8 253.5,30.4 254.8,29.1 254.8,28.92 P11.14
  Bottom 0.61: P1.14 56.1,28.2 57.6,29.7 74.02,29.7 | 74.02,29.7 P2.14 | 74.02,29.7 94.02,29.7 94.18,29.54 | 94.18,29.54 P3.14 | 94.18,29.54 94.34,29.54 94.5,29.7 114.02,29.7 P4.14 | 256.65,35.8 254.1,35.8 253.5,35.2 | 243.95,29.5 243.2,28.75 237.23,28.75 P10.14 | U108.4 255.04,41.78 R119.2
  pour Bottom: 276.8,30 51.3,29.9 51.25,27.1 276.6,27.2
BGND  (via drill 0.3, 0.6)
  Top 0.3: v262.65,31.4 262.65,31.05 262.55,30.95 | v272.6,33.35 272.6,33.05 272.7,32.95
  Top 0.406: v262.35,42.15 262.3,42.1 262.3,41.9 | v258.4,44.4 258.4,44.35 258.2,44.15 | v262.4,37.05 262.4,36.7 262.35,36.65
  Top 0.61: P1.12 53.56,27.62 P1.13 53.3,28.1 54.9,29.7 71.22,29.7 P2.13 | P2.13 73.56,27.62 P2.12 | P3.13 93.56,27.62 P3.12 | P4.12 113.56,27.62 P4.13 110.92,30 95.1,30 93.3,28.2 P3.13 | P2.13 73.3,28 75.2,29.9 91.02,29.9 P3.13 | P10.13 233.56,27.62 P10.12 | P11.13 253.56,27.62 P11.12 | P12.13 273.56,27.62 P12.12 | P9.13 213.56,27.62 P9.12 | P8.13 193.56,27.62 P8.12 | P7.13 173.56,27.62 P7.12 | P6.13 153.56,27.62 P6.12 | P5.13 133.56,27.62 P5.12 | v251.35,32.95 250.25,32.95 250.05,32.75
  Bottom 0.3: v262.65,31.4 262.71,31.46 C102.2 264.69,31.8 265.3,31.8 265.9,32.4 U103.2 | C103.2 272.51,33.26 v272.6,33.35
  Bottom 0.305: U103.2 266.15,32.4 265.75,32.8 265.75,33.15 265.95,33.35 U103.3
  Bottom 0.406: R120.1 v262.35,42.15 | C112.2 257.9,44.9 v258.4,44.4 | U104.2 U104.1 v262.39,37.05 v262.4,37.05 | R123.1 247.89,47.04 248.15,47.5 248.15,49.78 JP101.1
  Bottom 0.61: U105.2 251.5,33.1 v251.35,32.95
  pour Top (isolate 0.5): 296.5,55.8 297.1,24.4 51.2,24.4 51.05,32.5 243.2,32.8 244.8,32.8 247.5,35.4 247.5,56.8
CLK
  Bottom 0.15: 51.75,14.9 53.28,14.9 P1.3
  Bottom 0.305: P1.3 53.32,14.92 54.6,16.2 72.02,16.2 P2.3 73.42,14.92 74.7,16.2 92.02,16.2 P3.3 93.32,14.92 94.6,16.2 112.02,16.2 P4.3 113.3,15.1 114.4,16.2 132.02,16.2 P5.3 133.32,14.92 134.6,16.2 152.02,16.2 P6.3 153.42,14.92 154.7,16.2 172.02,16.2 P7.3 173.82,14.92 175.1,16.2 192.02,16.2 P8.3 193.62,14.92 194.9,16.2 212.02,16.2 P9.3 213.52,14.92 214.8,16.2 232.02,16.2 P10.3 233.3,15 234.5,16.2 252.02,16.2 P11.3 253.3,15.1 254.4,16.2 272.02,16.2 P12.3 | R114.2 50.3,14.85 51.75,14.9
CLKR
  Bottom 0.15: 49.65,12.71 R114.1
  Bottom 0.305: U101.6 47.85,13.95 49.15,12.65 49.65,12.71
DGND  (via drill 0.3, 0.6)  (1 unrouted)
  Top 0.15: v35.2,34.8 35.2,35 | v29.5,13.15 29.5,13 29.4,12.9
  Top 0.2: v90.75,44.2 90.75,44.1 90.7,44.05
  Top 0.254: v44.45,15.65 44.15,16.45 44.1,16.4 | v45.75,13.75 45.85,13.65 45.8,13.6 | v42.9,36.55 42.55,36.55 42.5,36.5 | v49.15,24.85 v49.15,25.65 | v49.15,24.05 49.15,23.95 49.05,24
  Top 0.3: v61.65,8.85 61.5,8.7 | v63.45,12.45 63.45,11.8 63.55,11.8 63.9,11.45 63.9,11.05 U100.2
  Top 0.305: v25.5,35.1 25.3,34.9
  Top 0.406: M1C.50 88.55,2.25 87.5,1.2 67.03,1.2 M1C.32 | 65.61,2.43 65.61,2.31 64.6,1.3 47.2,1.3 46.7,1.8 46.7,3.8 46.8,3.9 49.27,3.9 M1C.19 | v90.35,38.45 90.3,38.45 90.15,38.3 | v90.75,41.5 90.75,40.95 90.55,40.75 | v237.5,40.4 237.4,40.3 | v240.3,43.2 240.2,43.1 | v244.3,37.5 244.3,37.4 244.1,37.2
  Top 0.61: P9.11 211.42,25.08 210.4,26.1 v210.4,30.1
  Bottom 0.15: U102.46 35.15,35.05 v35.2,34.8 | U102.14 U102.15 29.25,13.4 v29.5,13.15
  Bottom 0.2: U109.2 90.95,44.4 v90.75,44.2
  Bottom 0.254: 44.35,15.9 44.35,16.55 v44.45,15.65 | C101.2 46.04,13.46 v45.75,13.75 | C105.2 42.86,36.51 v42.9,36.55 | P1.11 49.28,25.08 v49.15,24.85 | v49.15,25.65 49.2,24.25 v49.15,24.05
  Bottom 0.3: U100.2 62.35,10 61.65,9.3 v61.65,8.85 | C100.2 63.25,12.65 v63.45,12.45 | U101.2 44.65,15.6 44.35,15.9 | C104.2 34.9,35.1 v35.2,34.8
  Bottom 0.305: 67.23,1.2 M1C.32 65.61,2.43 64.8,1.3 51.89,1.3 50.64,2.35 | 50.64,2.35 M1C.20 | 50.64,2.35 50.25,2.35 | M1C.19 50.38,5.08 | U102.27 25.75,34.85 v25.5,35.1 25.25,34.85 U102.26
  Bottom 0.406: 240,44.35 241.7,44.35 242.15,43.9 | 242.73,44.2 243.4,44.2 244.3,43.3 244.3,39.02 U105.4 244.28,37.52 v244.3,37.5 | C113.1 91.89,47.26 91.9,47.25 | U106.2 90.45,38.55 v90.35,38.45 | C108.2 90.9,41.35 v90.75,41.5 | C107.2 237.7,40.6 v237.5,40.4 | C106.2 240.2,43.3 v240.3,43.2
  Bottom 0.61: R123.2 245.96,49.27 JP101.2
  Bottom 0.813: 242.73,44.2 242.15,43.9 | 242.37,37.95 U105.4
  pour Bottom: 45.45,25.9 280.4,25.8 280.4,23.7 45.45,23.8
  pour Bottom (isolate 0.4): -2.9,54.3 233.5,53.65 233.45,34 46.55,34 46.7,7.2 89.4,7.25 89.3,-2.6 -2.8,-3.4
  pour Top: 298.4,-5 299.3,11 49.55,11 49.6,34 244.1,34 246,35.9 246,53.1 -2,52.5 -2.8,-4.35
DQ0
  Bottom 0.15: 36.9,16.09 36.9,18.4 26.75,28.55 U102.29
  Bottom 0.254: M1A.18 36.9,16.09
DQ1
  Bottom 0.15: 38,17.53 38,18.7 27.75,28.95 U102.31
  Bottom 0.254: M1A.16 38,17.53
DQ2
  Bottom 0.15: 39.37,18.35 39.35,18.85 28.75,29.45 U102.33
  Bottom 0.254: M1A.14 39.37,18.35
DQ3
  Bottom 0.15: M1A.12 40.21,20.4 | 39.3,20.4 29.75,29.95 U102.35
  Bottom 0.254: 40.21,20.4 39.3,20.4
DQ4
  Bottom 0.15: M1A.10 40.25,22.9 | 38.8,22.9 31.25,30.45 U102.38
  Bottom 0.254: 40.25,22.9 38.8,22.9
DQ5
  Bottom 0.15: 38.3,25.4 32.25,31.45 U102.40
  Bottom 0.254: M1A.8 38.3,25.4
DQ6
  Bottom 0.15: M1A.6 40.23,28 | 37.6,28 33.25,32.35 U102.42
  Bottom 0.254: 40.23,28 37.6,28
DQ7
  Bottom 0.15: M1A.4 40.27,30.5 | 36.5,30.5 34.25,32.75 U102.44
  Bottom 0.254: 40.27,30.5 36.5,30.5
DQ8
  Bottom 0.15: 41.53,14 39.6,14 37.5,16.1 37.5,18.5 27.25,28.65 U102.30
  Bottom 0.254: M1A.17 41.53,14
DQ9
  Bottom 0.15: 41.57,16.5 39.6,16.5 38.5,17.6 38.5,19.1 28.25,29.35 U102.32
  Bottom 0.254: M1A.15 41.57,16.5
DQ10
  Bottom 0.15: 41.61,19 39.7,19 29.25,29.45 U102.34
  Bottom 0.254: M1A.13 41.61,19
DQ11
  Bottom 0.15: 41.55,21.6 38.9,21.6 30.25,30.25 U102.36
  Bottom 0.254: M1A.11 41.55,21.6
DQ12
  Bottom 0.15: 41.59,24.1 38.5,24.1 31.75,30.85 U102.39
  Bottom 0.254: M1A.9 41.59,24.1
DQ13
  Bottom 0.15: 41.63,26.6 38,26.6 32.75,31.85 U102.41
  Bottom 0.254: M1A.7 41.63,26.6
DQ14
  Bottom 0.15: 41.67,29.1 37.2,29.1 33.75,32.55 U102.43
  Bottom 0.254: M1A.5 41.67,29.1
DQ15
  Bottom 0.15: 41.71,31.6 36.1,31.6 34.75,32.95 U102.45
  Bottom 0.254: M1A.3 41.71,31.6
LED1
  Bottom 0.25: 107.3,44.2 108.55,44.2 110.1,45.75 199.5,45.75 J100.S
  Bottom 0.3: R122.1 99.45,46.2 101.45,44.2 107.3,44.2
LED1_INV  (1 unrouted)
  Bottom 0.25: JP106.1 188.62,48.84 R127.2 187.16,46.25 107.9,46.25 104.85,49.3 61.7,49.3 60.66,48.26
LED2
  Bottom 0.25: 108,43.5 108.6,43.5 110.35,45.25 176.55,45.25 J102.S
  Bottom 0.3: R121.1 108,43.5
LED2_INV
  Bottom 0.2: 60.15,49.7 60.3,49.7 60.4,49.8 105.1,49.8 108.05,46.7 164.26,46.7 R124.2
  Bottom 0.25: R124.2 165.81,50.56 JP105.1 | 58.71,48.26 60.15,49.7
  Bottom 0.305: 58.71,48.26 M1B.25
MISO1
  Bottom 0.3: R103.2 67.8,8.5 67,7.7 67,3.77 M1C.34
MISO1R
  Bottom 0.3: P1.2 56.18,12.38 57.7,13.9 66.5,13.9 67.8,12.6 R103.1
MISO2
  Bottom 0.3: M1C.33 68.23,6.63 70.3,8.7 R102.2
MISO3
  Bottom 0.3: M1C.36 70.16,2.54 69.5,3.2 69.5,6.9 71.5,8.9 73.6,8.9 75.8,11.1 76.8,11.1 77.9,12.2 83.01,12.2 R112.2
MISO4
  Bottom 0.3: M1C.35 70.77,7.17 71.9,8.3 73.9,8.3 76.15,10.5 78.3,10.5 78.7,10.95 85.1,10.9 85.5,10.5 97.3,10.5 99.3,12.5 104.26,12.5 R113.2
MISO5
  Bottom 0.3: R111.2 123.2,11.4 122.4,10.6 116.3,10.6 115.6,9.9 111.4,9.9 110.2,11.2 99.4,11.15 98.25,9.9 76.6,9.9 74.3,7.6 72.9,7.6 72,6.7 72,3.2 72.66,2.54 M1C.38
MISO6
  Bottom 0.3: R109.2 137.4,11 136.5,10.1 117.1,10.1 116,9.3 110.25,9.3 109.55,10 99.55,10 98.85,9.3 77,9.3 74.6,6.9 73.8,6.9 73.2,6.3 73.2,5.19 M1C.37
MISO7
  Bottom 0.3: R110.2 161,11.1 160.4,10.55 147.1,10.55 146,9.5 136.9,9.5 136.7,9.3 117.4,9.3 116.65,8.75 109.75,8.75 109.2,9.3 100,9.3 99.45,8.75 77.45,8.75 74.6,5.9 74.6,3.79 M1C.40
MISO8
  Bottom 0.3: M1C.39 75.85,6.05 78.05,8.25 99.85,8.25 100.35,8.75 108.7,8.75 109.25,8.2 145.95,8.25 147.6,9.85 182.26,9.85 R108.2
MISO9
  Bottom 0.3: R107.2 199.4,10.9 198.1,9.6 183.5,9.6 183.05,9.25 147.9,9.25 146.35,7.7 108.85,7.7 108.35,8.2 100.7,8.2 100.2,7.7 81.5,7.7 79.7,6 79.7,3.77 M1C.44
MISO10
  Bottom 0.3: R104.2 222.8,10.8 221.5,9.5 199.3,9.5 198.5,8.7 183.7,8.7 182.85,8.6 148.35,8.6 146.9,7.15 108.65,7.1 108.2,7.55 101,7.55 100.55,7.1 82.75,7.1 82,7.1 80.9,6 80.9,5.11 M1C.43
MISO11
  Bottom 0.3: R106.2 244.41,10.86 242.35,8.8 199.65,8.8 198.95,8.1 148.7,8.1 147.15,6.55 108.55,6.5 108,7 101.4,7 100.95,6.55 83,6.55 82.2,5.75 82.2,3.75 83.41,2.54 M1C.46
MISO12
  Bottom 0.3: M1C.45 83.72,5.08 84.65,4.15 84.65,1.8 85.3,1.15 254.46,1.15 R105.2
MOSI  (1 unrouted)
  Top 0.254: 211.98,13.7 P9.1 | 213.32,12.38 213.32,12.62 214.4,13.7
  Top 0.3: 93.42,12.38 93.42,12.52 94.6,13.7 111.98,13.7 P4.1 | 113.62,12.38 113.62,12.62 114.7,13.7 131.98,13.7 P5.1 133.38,12.38 134.7,13.7 151.98,13.7 P6.1 | P7.1 173.3,12.4 174.6,13.7 191.98,13.7 P8.1 193.38,12.38 194.7,13.7 211.98,13.7 | 214.4,13.7 231.98,13.7 P10.1 233.3,12.5 234.5,13.7 251.98,13.7 P11.1 253.48,12.38 254.7,13.6 272.08,13.6 P12.1 | P3.1 93.28,12.4 78.1,12.4 76.7,11 74.8,11 73.42,12.38 P2.1 71.82,12.38 70.55,13.65 54.57,13.65 P1.1
  Top 0.305: P3.1 93.42,12.38 | P4.1 113.62,12.38 | P5.1 133.3,12.3 | P6.1 153.62,12.38 154.9,13.6 171.6,13.6 173,12.4 173.28,12.4 P7.1 173.3,12.3
  Bottom 0.3: R100.2 56.1,9.05 55.75,8.7 51.3,8.7 50.65,9.35 50.65,10.75 52.2,12.3
  Bottom 0.305: P8.1 193.3,12.3 | P10.1 233.3,12.3 | P11.1 253.3,12.1
  Bottom 0.406: 52.2,12.3 53.22,12.3 P1.1
MOSIR
  Bottom 0.15: R100.1 60.4,9 U100.4
N$1
  Bottom 0.61: R117.2 253.18,39.2 U105.1
N$2
  Bottom 0.3: U109.6 94.3,43.45 94.35,43.4 97.41,43.4 R121.2
N$3
  Bottom 0.3: U108.1 241.03,41.78 239.95,40.8 239.95,37.96 R115.2
N$4  (via drill 0.3)  (1 unrouted)
  Top 0.3: v237.05,36.45 237.05,36.1 236.45,35.4 52.7,35.4 50.1,38 48.3,38 42.95,43.35 42.95,45.6
  Top 0.305: 42.95,45.6 M1B.14
  Bottom 0.3: 238.21,36.36 v237.05,36.45
N$5  (via drill 3.17 pad 6.45, 6.4 pad 6.45)  (1 unrouted)
  other vias: 10,6.35 10,31.75
N$6  (via drill 6.35 pad 10)  (1 unrouted)
  other vias: 10,18 289.4,18
N$7
  Bottom 0.3: U103.4 269.4,33.45 268.75,34.1 265.21,34.1 C102.1
N$12  (via drill 3.17 pad 6.45, 6.4 pad 6.45)  (1 unrouted)
  other vias: 289.4,6.35 289.4,31.75
N$13
  Bottom 0.3: R102.1 73.89,10.17 P2.2
N$14
  Bottom 0.3: P3.2 96.1,12 95.1,11 85.99,11 R112.1
N$15
  Bottom 0.406: U104.8 256.75,37.05 257.2,37.5 R117.1
N$16  (1 unrouted)
  Bottom 0.3: U106.3 89.05,39.5 87.95,38.4 64.1,38.4 60.65,41.85 60.65,45.68
N$18
  Bottom 0.406: R119.1 259.01,42.1 R120.2 259.1,42.11 259.1,40.9 260.6,39.4 262.8,39.4 263.55,38.65 263.55,35.35 262.71,34.52 U104.3
N$21
  Bottom 0.3: U106.6 96.81,37.6 R116.1
N$23
  Bottom 0.3: U106.4 94.95,39.5 96.3,40.85 97.26,40.85 R118.1
N$24
  Bottom 0.3: R113.1 110.7,12.3 112.2,10.8 114.52,10.8 P4.2
N$25
  Bottom 0.3: P5.2 136.1,11.6 135.3,10.8 125.99,10.8 R111.1
N$28
  Bottom 0.3: P6.2 156.1,11.5 155.65,11.1 146.04,11.1 R109.1
N$31
  Bottom 0.3: P12.2 276.1,11.7 275.3,10.9 R105.1
N$32
  Bottom 0.3: P11.2 256.1,11.5 255.3,10.7 246.39,10.7 R106.1
N$33
  Bottom 0.3: P10.2 236.1,11.3 235.4,10.6 225.89,10.6 R104.1
N$34
  Bottom 0.3: P9.2 216.1,11.7 215.6,11.2 215.5,11.2 215.1,10.8 205.99,10.8 R107.1
N$35
  Bottom 0.3: R108.1 194.72,11 P8.2
N$36
  Bottom 0.3: P7.2 176.1,12 175,10.9 165.69,10.9 R110.1
N$37
  Bottom 0.3: U109.4 94.05,45.4 94.7,45.4 95.5,46.2 R122.2
OE#
  Bottom 0.254: 30.13,44.53 M1B.4
  Bottom 0.305: 30.13,44.53 26.25,40.65 U102.28
REF
  Bottom 0.406: U104.4 260.56,33.24 260.5,33.3 255.21,33.3 U104.5 U104.6
SERIAL  (via drill 0.3)
  Top 0.254: v46.05,31.65 46.05,35.65 39.05,42.65 36.2,42.65 33.9,44.95 33.9,49 34.3,49.4 44.23,49.4 M1B.15
  Bottom 0.254: U101.3 45.55,20.85 46.05,21.4 v46.05,31.65
SERIALOUT
  Bottom 0.254: 106.8,36.85 112.65,36.85 J1.2
  Bottom 0.3: U101.4 47.85,17.1 48.15,17.4 48.15,31.45 53.15,36.45 106.4,36.45 106.8,36.85
SYNC
  Bottom 0.25: 106.8,41.05 107.15,41.05 110.9,44.8 153.55,44.8 J101.S
  Bottom 0.3: R118.2 106.8,41.05
SYNC_INV  (1 unrouted)
  Bottom 0.2: 55.86,48.26 57.8,50.2 105.35,50.2 108.35,47.1 140.2,47.1 141,48.1 | 141,48.1 141.1,48.2 | 141,48.1 142.41,48.1 R125.2 142.46,50.36 JP103.1
TEN
  Top 0.3: 35.84,48.26 36.5,47.6 36.5,45.3 37.6,44.2 40,44.2 51.3,32.9 51.35,20.45 51.9,19.9 53.2,19.9 P1.7
  Top 0.305: 35.84,48.26 M1B.7
  Bottom 0.305: 53.3,20.1 P1.7 53.4,20 54.7,18.7 58.1,18.7 59.4,20 P2.7 73.3,19.9 74.5,18.7 77.1,18.7 78.4,20 P3.7 94.6,18.7 97.5,18.7 98.8,20 P4.7 113.3,19.9 114.5,18.7 117.3,18.7 118.6,20 P5.7 134.6,18.7 152,18.7 P6.7 153.4,20 154.6,18.8 172.1,18.8 P7.7 173.5,20 174.8,18.7 192,18.7 P8.7 193.3,19.9 194.5,18.7 212,18.7 P9.7 213.4,20 214.6,18.8 232.1,18.8 P10.7 233.4,20 234.6,18.8 252.1,18.8 P11.7 253.3,19.9 254.5,18.7 272,18.7 P12.7
TMI1  (1 unrouted)
  Top 0.3: P1.5 51.29,17.46 50.2,18.55 50.2,32.75 39.6,43.5 36.9,43.5 35.21,45.59
TMO1
  Bottom 0.305: P1.6 P2.5
TMO2
  Bottom 0.305: P2.6 P3.5
TMO3
  Bottom 0.305: P3.6 P4.5
TMO4
  Bottom 0.305: P4.6 P5.5
TMO5
  Bottom 0.305: P5.6 P6.5
TMO6
  Bottom 0.254: P6.6 P7.5
  Bottom 0.305: 173.27,17.49 P7.5
TMO7
  Bottom 0.305: 193.25,17.52 P8.5 P7.6
TMO8
  Bottom 0.305: P8.6 P9.5
TMO9
  Bottom 0.305: P9.6 P10.5
TMO10
  Bottom 0.305: P10.6 P11.5
TMO11
  Bottom 0.305: P11.6 P12.5
TMO12  (via drill 0.3)
  Top 0.3: v269.75,12.45 270,12.45 272.4,10.05 276.45,10.05 277.95,11.55 277.95,15.61 P12.6
  Bottom 0.3: M1C.47 86.12,5.08 87.35,3.85 99.3,3.85 101.85,6.4 107.45,6.4 108.15,5.7 147.3,5.7 148.9,7.3 257.3,7.3 262.4,12.4 269.7,12.4 v269.75,12.45
UCLK
  Bottom 0.15: M1C.27 60.42,5.08 | 59,6.5 57.3,6.5 55.5,8.3 49.7,8.3 47.6,10.4 45.85,10.4 45.1,11.15 45.1,14.2
  Bottom 0.305: 60.42,5.08 59,6.5 | 45.1,14.2 U101.1
UCS
  Bottom 0.3: M1C.30 63.34,2.54 64.4,3.6 64.4,10.25 63.7,10.95 U100.1
ULED1  (via drill 0.3)
  Top 0.3: v62.8,42.35 57.85,42.35 v57.8,42.3
  Bottom 0.3: U109.3 90.6,45.35 89.35,44.1 88.05,44.1 87.1,43.15 87.1,41.15 85.75,39.8 66.7,39.8 64.55,41.95 63.2,41.95 v62.8,42.35 | v57.8,42.3 45.95,42.3 44.05,44.2 44.05,46.1 43.15,47 41.55,47
  Bottom 0.305: 41.55,47 M1B.11
ULED2
  Bottom 0.3: U109.1 88.5,43.45 87.6,42.55 87.6,40.55 86.15,39.1 64.55,39.1 61.85,41.8 61.85,46.6 61.45,47 44.09,47
  Bottom 0.305: 44.09,47 M1B.13
UMOSI
  Bottom 0.3: M1C.29 63.15,8.75 U100.3
VCHECK  (via drill 0.3)  (1 unrouted)
  Top 0.3: 57.9,34.75 v240.75,34.75
  Top 0.406: 57.9,34.75 52.05,34.75 49.7,37.1 48.1,37.1 40.4,44.8 40.4,45.61
  Bottom 0.3: v240.75,34.75 242.57,34.75 U105.3
VIN
  Bottom 0.61: J105.1B J105.1A 225.4,41.55 C110.1 226.24,39.65 227.4,39.65 | C109.1 227.4,39.65 | U107.1 228.75,46.05 228.2,45.5 228.2,40.45 227.4,39.65
WE#
  Bottom 0.15: U102.11 31.25,12.95 31.65,12.55 31.65,12.45 37.4,6.7 41.2,6.7 42,5.9 42.36,5.9
  Bottom 0.254: 42.36,5.9 M1C.13

### Text on the board
tPlace: 6-9VDC | EARTH | RGB SERIAL | BATTERY / 3xAA | AUX OUT | SYNC OUT | LED2 | LED1 | 1 | 2 | 3 | 4 | 5 | 6 | 7 | 8 | 9 | 10 | 11 | 12 | 12_BP_FPGA_J008340C | 20240501
bPlace: GND JMP | BATTERY / 3xAA | SERIAL | GND | OUT | 3v3 | SYNC / OUT | LED2 | LED1 | AUX / OUT